# EasyEDA schematic SCH_Optical Endstops_2025-04-08.json
TITLE: Sheet_1; REV: 1.0; Date: 2025-03-08; Sheet: 1/1; Drawn By: esemv; Company: Your Company
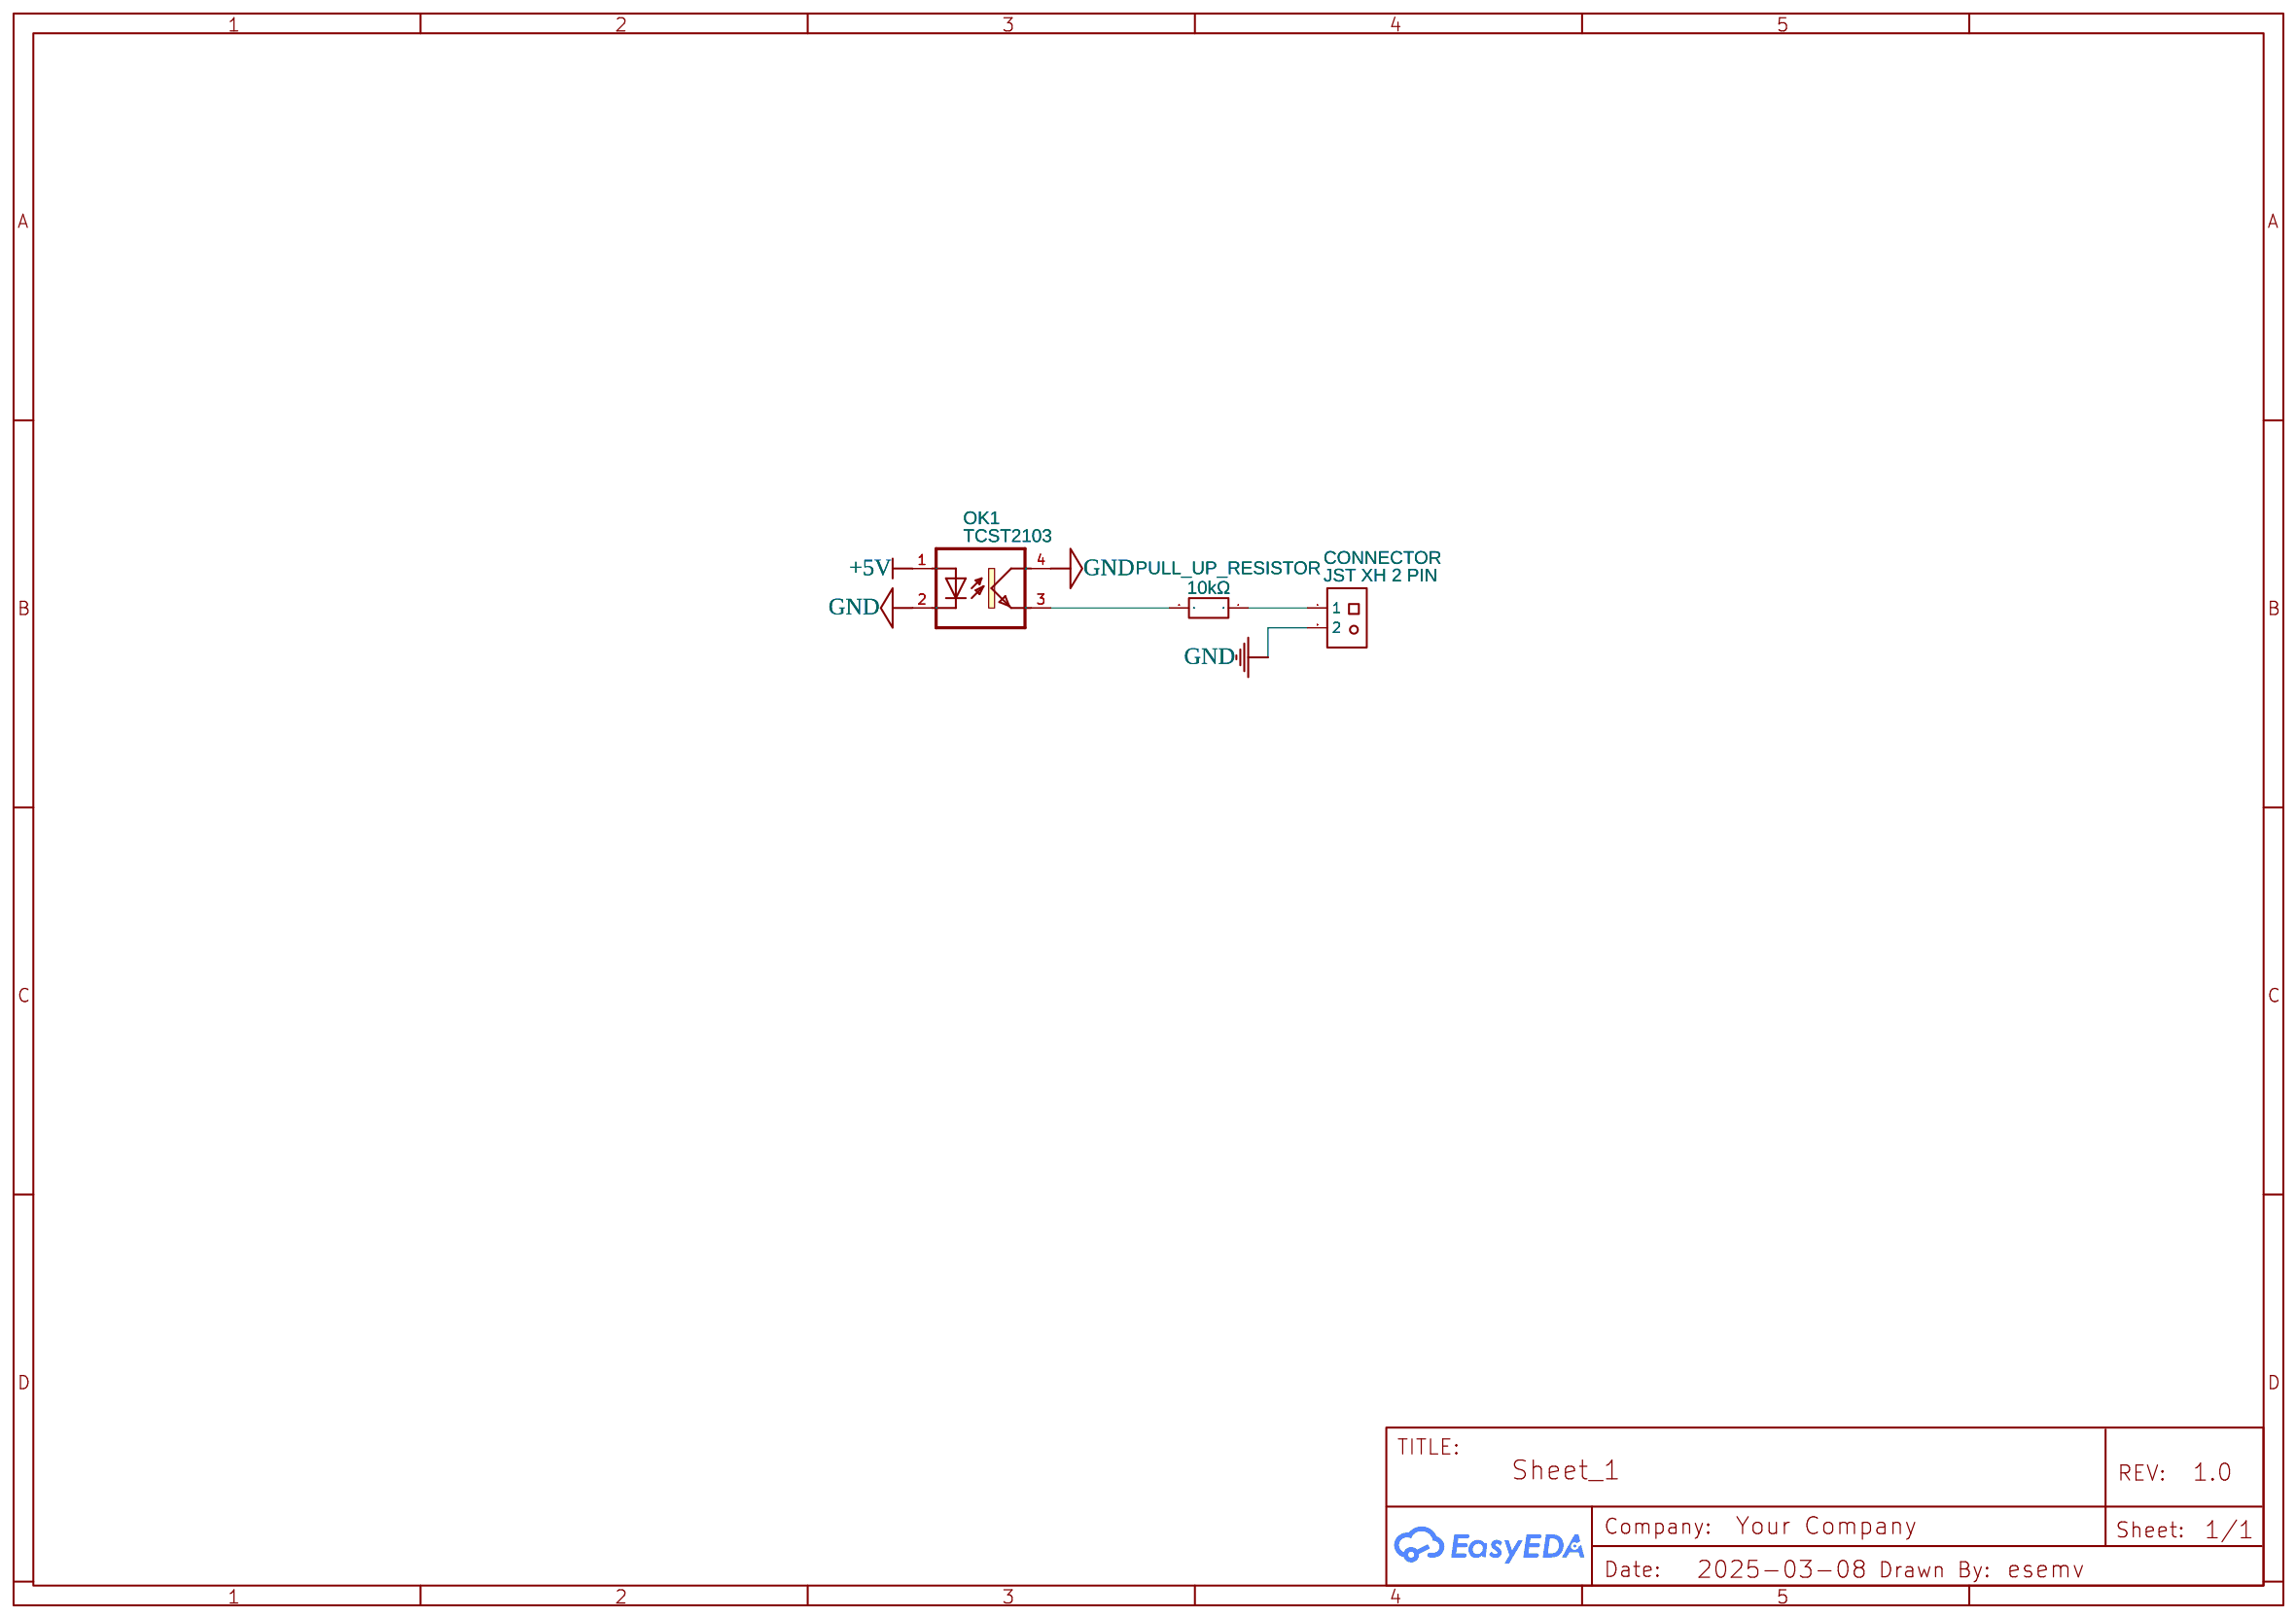
[diagram p0: schematic sheet]

## Parts
CONNECTOR  JST XH 2 PIN  [JST_2-PIN_2.54MM]
OK1  TCST2103  [TCST-2103]
PULL_UP_RESISTOR  10kΩ  [RES-TH_L18.3-W6.5-P22.30-D0.8]

## Library data of the parts
CONNECTOR = JST XH 2 PIN: Manufacturer Part: JST_XH CONNECTOR; link: https://nl.aliexpress.com/item/50-sets-Kit-in-doos-2-p-3-p-4-pin-2-54mm-Pitch-Terminal-Behuizing/32681086028.html?spm=a2g0s.9042311.0.0.I0g15Z; Contributor: CowboyWillT
OK1 = TCST2103: Contributor: Голиков Александр Юрьевич; Manufacturer: VISHAY
PULL_UP_RESISTOR = MMFR6518B10K0V9: Supplier: LCSC; Supplier Part: C18164694; Manufacturer: RESI(开步睿思); Contributor: lcsc; link: https://lcsc.com/eda_search?q=C18164694&%26type=1&ref=editor

## Nets
+5V: OK1.1(A)
GND: CONNECTOR.2 OK1.2(C) OK1.4(COL)
Net-(CONNECTOR-1): CONNECTOR.1 PULL_UP_RESISTOR.1
Net-(OK1-3): OK1.3(EMIT) PULL_UP_RESISTOR.2
